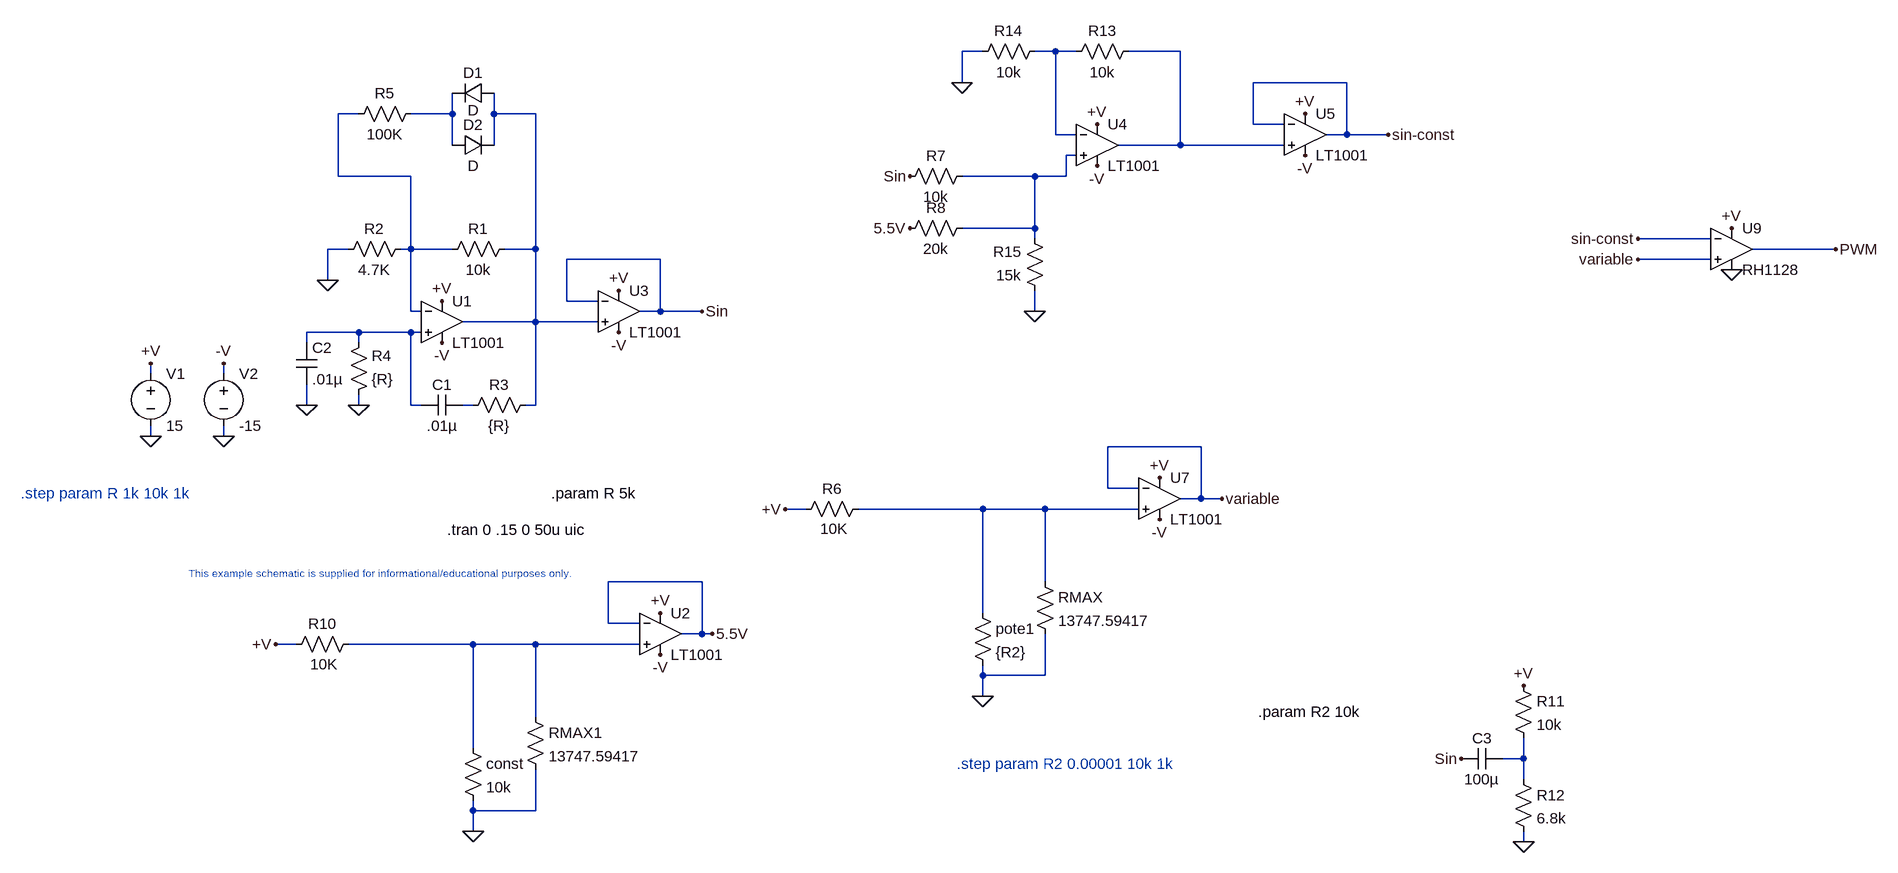
[diagram p0: schematic pwm.asc]
pwm.asc, the LTspice schematic file:
Version 4
SHEET 1 2516 872
WIRE 992 -448 960 -448
WIRE 1104 -448 1072 -448
WIRE 1136 -448 1104 -448
WIRE 1296 -448 1216 -448
WIRE 960 -400 960 -448
WIRE 1552 -400 1408 -400
WIRE 32 -352 0 -352
WIRE 176 -352 176 -384
WIRE 176 -352 112 -352
WIRE 240 -352 240 -384
WIRE 304 -352 240 -352
WIRE 1408 -336 1408 -400
WIRE 1456 -336 1408 -336
WIRE 1104 -320 1104 -448
WIRE 1136 -320 1104 -320
WIRE 1552 -320 1552 -400
WIRE 1552 -320 1520 -320
WIRE 1616 -320 1552 -320
WIRE 176 -304 176 -352
WIRE 240 -304 240 -352
WIRE 1296 -304 1296 -448
WIRE 1296 -304 1200 -304
WIRE 1456 -304 1296 -304
WIRE 1136 -288 1120 -288
WIRE 0 -256 0 -352
WIRE 112 -256 0 -256
WIRE 1072 -256 960 -256
WIRE 1120 -256 1120 -288
WIRE 1120 -256 1072 -256
WIRE 1072 -176 1072 -256
WIRE 1072 -176 960 -176
WIRE 1072 -160 1072 -176
WIRE 2112 -160 2000 -160
WIRE 16 -144 -16 -144
WIRE 112 -144 112 -256
WIRE 112 -144 96 -144
WIRE 176 -144 112 -144
WIRE 304 -144 304 -352
WIRE 304 -144 256 -144
WIRE 2304 -144 2176 -144
WIRE 496 -128 352 -128
WIRE 2112 -128 2000 -128
WIRE -16 -96 -16 -144
WIRE 352 -64 352 -128
WIRE 400 -64 352 -64
WIRE 112 -48 112 -144
WIRE 128 -48 112 -48
WIRE 496 -48 496 -128
WIRE 496 -48 464 -48
WIRE 560 -48 496 -48
WIRE 1072 -48 1072 -80
WIRE 304 -32 304 -144
WIRE 304 -32 192 -32
WIRE 400 -32 304 -32
WIRE 32 -16 -48 -16
WIRE 112 -16 32 -16
WIRE 128 -16 112 -16
WIRE -48 0 -48 -16
WIRE 32 0 32 -16
WIRE -288 48 -288 32
WIRE -176 48 -176 32
WIRE -48 96 -48 64
WIRE 32 96 32 80
WIRE 112 96 112 -16
WIRE 128 96 112 96
WIRE 208 96 192 96
WIRE 304 96 304 -32
WIRE 304 96 288 96
WIRE -288 144 -288 128
WIRE -176 144 -176 128
WIRE 1328 160 1184 160
WIRE 1184 224 1184 160
WIRE 1232 224 1184 224
WIRE 1328 240 1328 160
WIRE 1328 240 1296 240
WIRE 1360 240 1328 240
WIRE 720 256 688 256
WIRE 992 256 800 256
WIRE 1088 256 992 256
WIRE 1232 256 1088 256
WIRE 560 368 416 368
WIRE 1088 368 1088 256
WIRE 992 416 992 256
WIRE 416 432 416 368
WIRE 464 432 416 432
WIRE 560 448 560 368
WIRE 560 448 528 448
WIRE 576 448 560 448
WIRE -64 464 -96 464
WIRE 208 464 16 464
WIRE 304 464 208 464
WIRE 464 464 304 464
WIRE 992 512 992 496
WIRE 1088 512 1088 448
WIRE 1088 512 992 512
WIRE 992 544 992 512
WIRE 304 576 304 464
WIRE 208 624 208 464
WIRE 1824 640 1824 608
WIRE 1824 640 1792 640
WIRE 1824 672 1824 640
WIRE 208 720 208 704
WIRE 304 720 304 656
WIRE 304 720 208 720
WIRE 208 752 208 720
WIRE 1824 768 1824 752
FLAG 160 -64 +V
FLAG 160 0 -V
FLAG -288 32 +V
FLAG -176 144 0
FLAG -288 144 0
FLAG -176 32 -V
FLAG 32 96 0
FLAG -48 96 0
FLAG 432 -80 +V
FLAG 432 -16 -V
FLAG -16 -96 0
FLAG 688 256 +V
FLAG 992 544 0
FLAG 1168 -336 +V
FLAG 1168 -272 -V
FLAG 560 -48 Sin
FLAG 880 -256 Sin
FLAG -96 464 +V
FLAG 208 752 0
FLAG 576 448 5.5V
FLAG 880 -176 5.5V
FLAG 496 416 +V
FLAG 496 480 -V
FLAG 1728 640 Sin
FLAG 1824 528 +V
FLAG 1824 768 0
FLAG 960 -400 0
FLAG 1072 -48 0
FLAG 1616 -320 sin-const
FLAG 1488 -352 +V
FLAG 1488 -288 -V
FLAG 1360 240 variable
FLAG 2000 -128 variable
FLAG 2000 -160 sin-const
FLAG 2144 -176 +V
FLAG 1264 208 +V
FLAG 1264 272 -V
FLAG 2144 -112 0
FLAG 2304 -144 PWM
SYMBOL voltage -288 32 R0
SYMATTR InstName V1
SYMATTR Value 15
SYMBOL voltage -176 32 R0
SYMATTR InstName V2
SYMATTR Value -15
SYMBOL res 272 -160 R90
WINDOW 0 0 56 VBottom 2
WINDOW 3 32 56 VTop 2
SYMATTR InstName R1
SYMATTR Value 10k
SYMBOL res 112 -160 R90
WINDOW 0 0 56 VBottom 2
WINDOW 3 32 56 VTop 2
SYMATTR InstName R2
SYMATTR Value 4.7K
SYMBOL res 304 80 R90
WINDOW 0 0 56 VBottom 2
WINDOW 3 32 56 VTop 2
SYMATTR InstName R3
SYMATTR Value {R}
SYMBOL res 16 96 M180
WINDOW 0 36 76 Left 2
WINDOW 3 36 40 Left 2
SYMATTR InstName R4
SYMATTR Value {R}
SYMBOL cap 192 80 R90
WINDOW 0 0 32 VBottom 2
WINDOW 3 32 32 VTop 2
SYMATTR InstName C1
SYMATTR Value .01µ
SYMBOL cap -64 0 R0
SYMATTR InstName C2
SYMATTR Value .01µ
SYMBOL opamps\\LT1001 160 -96 R0
SYMATTR InstName U1
SYMBOL diode 240 -400 R90
WINDOW 0 0 32 VBottom 2
WINDOW 3 27 32 VTop 2
SYMATTR InstName D1
SYMBOL diode 176 -288 R270
WINDOW 0 32 32 VTop 2
WINDOW 3 0 32 VBottom 2
SYMATTR InstName D2
SYMBOL res 128 -368 R90
WINDOW 0 0 56 VBottom 2
WINDOW 3 32 56 VTop 2
SYMATTR InstName R5
SYMATTR Value 100K
SYMBOL res 816 240 R90
WINDOW 0 0 56 VBottom 2
WINDOW 3 62 53 VBottom 2
SYMATTR InstName R6
SYMATTR Value 10K
SYMBOL res 976 400 R0
SYMATTR InstName pote1
SYMATTR Value {R2}
SYMBOL res 1072 352 R0
SYMATTR InstName RMAX
SYMATTR Value 13747.59417
SYMBOL res 976 -272 R90
WINDOW 0 0 56 VBottom 2
WINDOW 3 32 56 VTop 2
SYMATTR InstName R7
SYMATTR Value 10k
SYMBOL res 976 -192 R90
WINDOW 0 0 56 VBottom 2
WINDOW 3 32 56 VTop 2
SYMATTR InstName R8
SYMATTR Value 20k
SYMBOL res 32 448 R90
WINDOW 0 0 56 VBottom 2
WINDOW 3 62 53 VBottom 2
SYMATTR InstName R10
SYMATTR Value 10K
SYMBOL res 192 608 R0
SYMATTR InstName const
SYMATTR Value 10k
SYMBOL res 288 560 R0
SYMATTR InstName RMAX1
SYMATTR Value 13747.59417
SYMBOL cap 1792 624 R90
WINDOW 0 0 32 VBottom 2
WINDOW 3 32 32 VTop 2
SYMATTR InstName C3
SYMATTR Value 100µ
SYMBOL res 1808 512 R0
SYMATTR InstName R11
SYMATTR Value 10k
SYMBOL res 1808 656 R0
SYMATTR InstName R12
SYMATTR Value 6.8k
SYMBOL res 1232 -464 R90
WINDOW 0 0 56 VBottom 2
WINDOW 3 32 56 VTop 2
SYMATTR InstName R13
SYMATTR Value 10k
SYMBOL res 1088 -464 R90
WINDOW 0 0 56 VBottom 2
WINDOW 3 32 56 VTop 2
SYMATTR InstName R14
SYMATTR Value 10k
SYMBOL res 1088 -64 R180
WINDOW 0 36 76 Left 2
WINDOW 3 36 40 Left 2
SYMATTR InstName R15
SYMATTR Value 15k
SYMBOL OpAmps\\LT1001 496 384 R0
SYMATTR InstName U2
SYMBOL OpAmps\\LT1001 432 -112 R0
SYMATTR InstName U3
SYMBOL OpAmps\\LT1001 1168 -368 R0
SYMATTR InstName U4
SYMBOL OpAmps\\LT1001 1488 -384 R0
SYMATTR InstName U5
SYMBOL OpAmps\\LT1001 1264 176 R0
SYMATTR InstName U7
SYMBOL OpAmps\\RH1128 2144 -208 R0
SYMATTR InstName U9
TEXT 168 288 Left 2 !.tran 0 .15 0 50u uic
TEXT 56 344 Top 1 ;This example schematic is supplied for informational/educational purposes only.
TEXT 328 232 Left 2 !.param R 5k
TEXT -488 232 Left 2 ;.step param R 1k 10k 1k
TEXT 952 648 Left 2 ;.step param R2 0.00001 10k 1k
TEXT 1416 568 Left 2 !.param R2 10k

The netlist it stands for:
* pwm.asc
V1 +V 0 15
V2 -V 0 -15
R1 N005 N003 10k
R2 N003 0 4.7K
R3 N005 N008 {R}
R4 0 N007 {R}
C1 N008 N007 .01µ
C2 N007 0 .01µ
XU1 N007 N003 +V -V N005 LT1001  ; pins In+ In- V+ V- OUT
D1 N005 N004 D
D2 N004 N005 D
R5 N004 N003 100K
R6 N009 +V 10K
R§pote1 N009 0 {R2}
RMAX N009 0 13747.59417
R7 N006 Sin 10k
R8 N006 5.5V 20k
R10 N010 +V 10K
R§const N010 0 10k
RMAX1 N010 0 13747.59417
C3 N011 Sin 100µ
R11 +V N011 10k
R12 N011 0 6.8k
R13 N002 N001 10k
R14 N001 0 10k
R15 0 N006 15k
XU2 N010 5.5V +V -V 5.5V LT1001  ; pins In+ In- V+ V- OUT
XU3 N005 Sin +V -V Sin LT1001  ; pins In+ In- V+ V- OUT
XU4 N006 N001 +V -V N002 LT1001  ; pins In+ In- V+ V- OUT
XU5 N002 sin-const +V -V sin-const LT1001  ; pins In+ In- V+ V- OUT
XU7 N009 variable +V -V variable LT1001  ; pins In+ In- V+ V- OUT
XU9 variable sin-const +V 0 PWM RH1128  ; pins In+ In- V+ V- OUT
.model D D
.lib standard.dio
.tran 0 .15 0 50u uic
* This example schematic is supplied for informational/educational purposes only.
.param R 5k
* .step param R 1k 10k 1k
* .step param R2 0.00001 10k 1k
.param R2 10k
.lib LTC.lib
.backanno
.end